# EAGLE design Adafruit Gemma rev B (EAGLE 6.4)
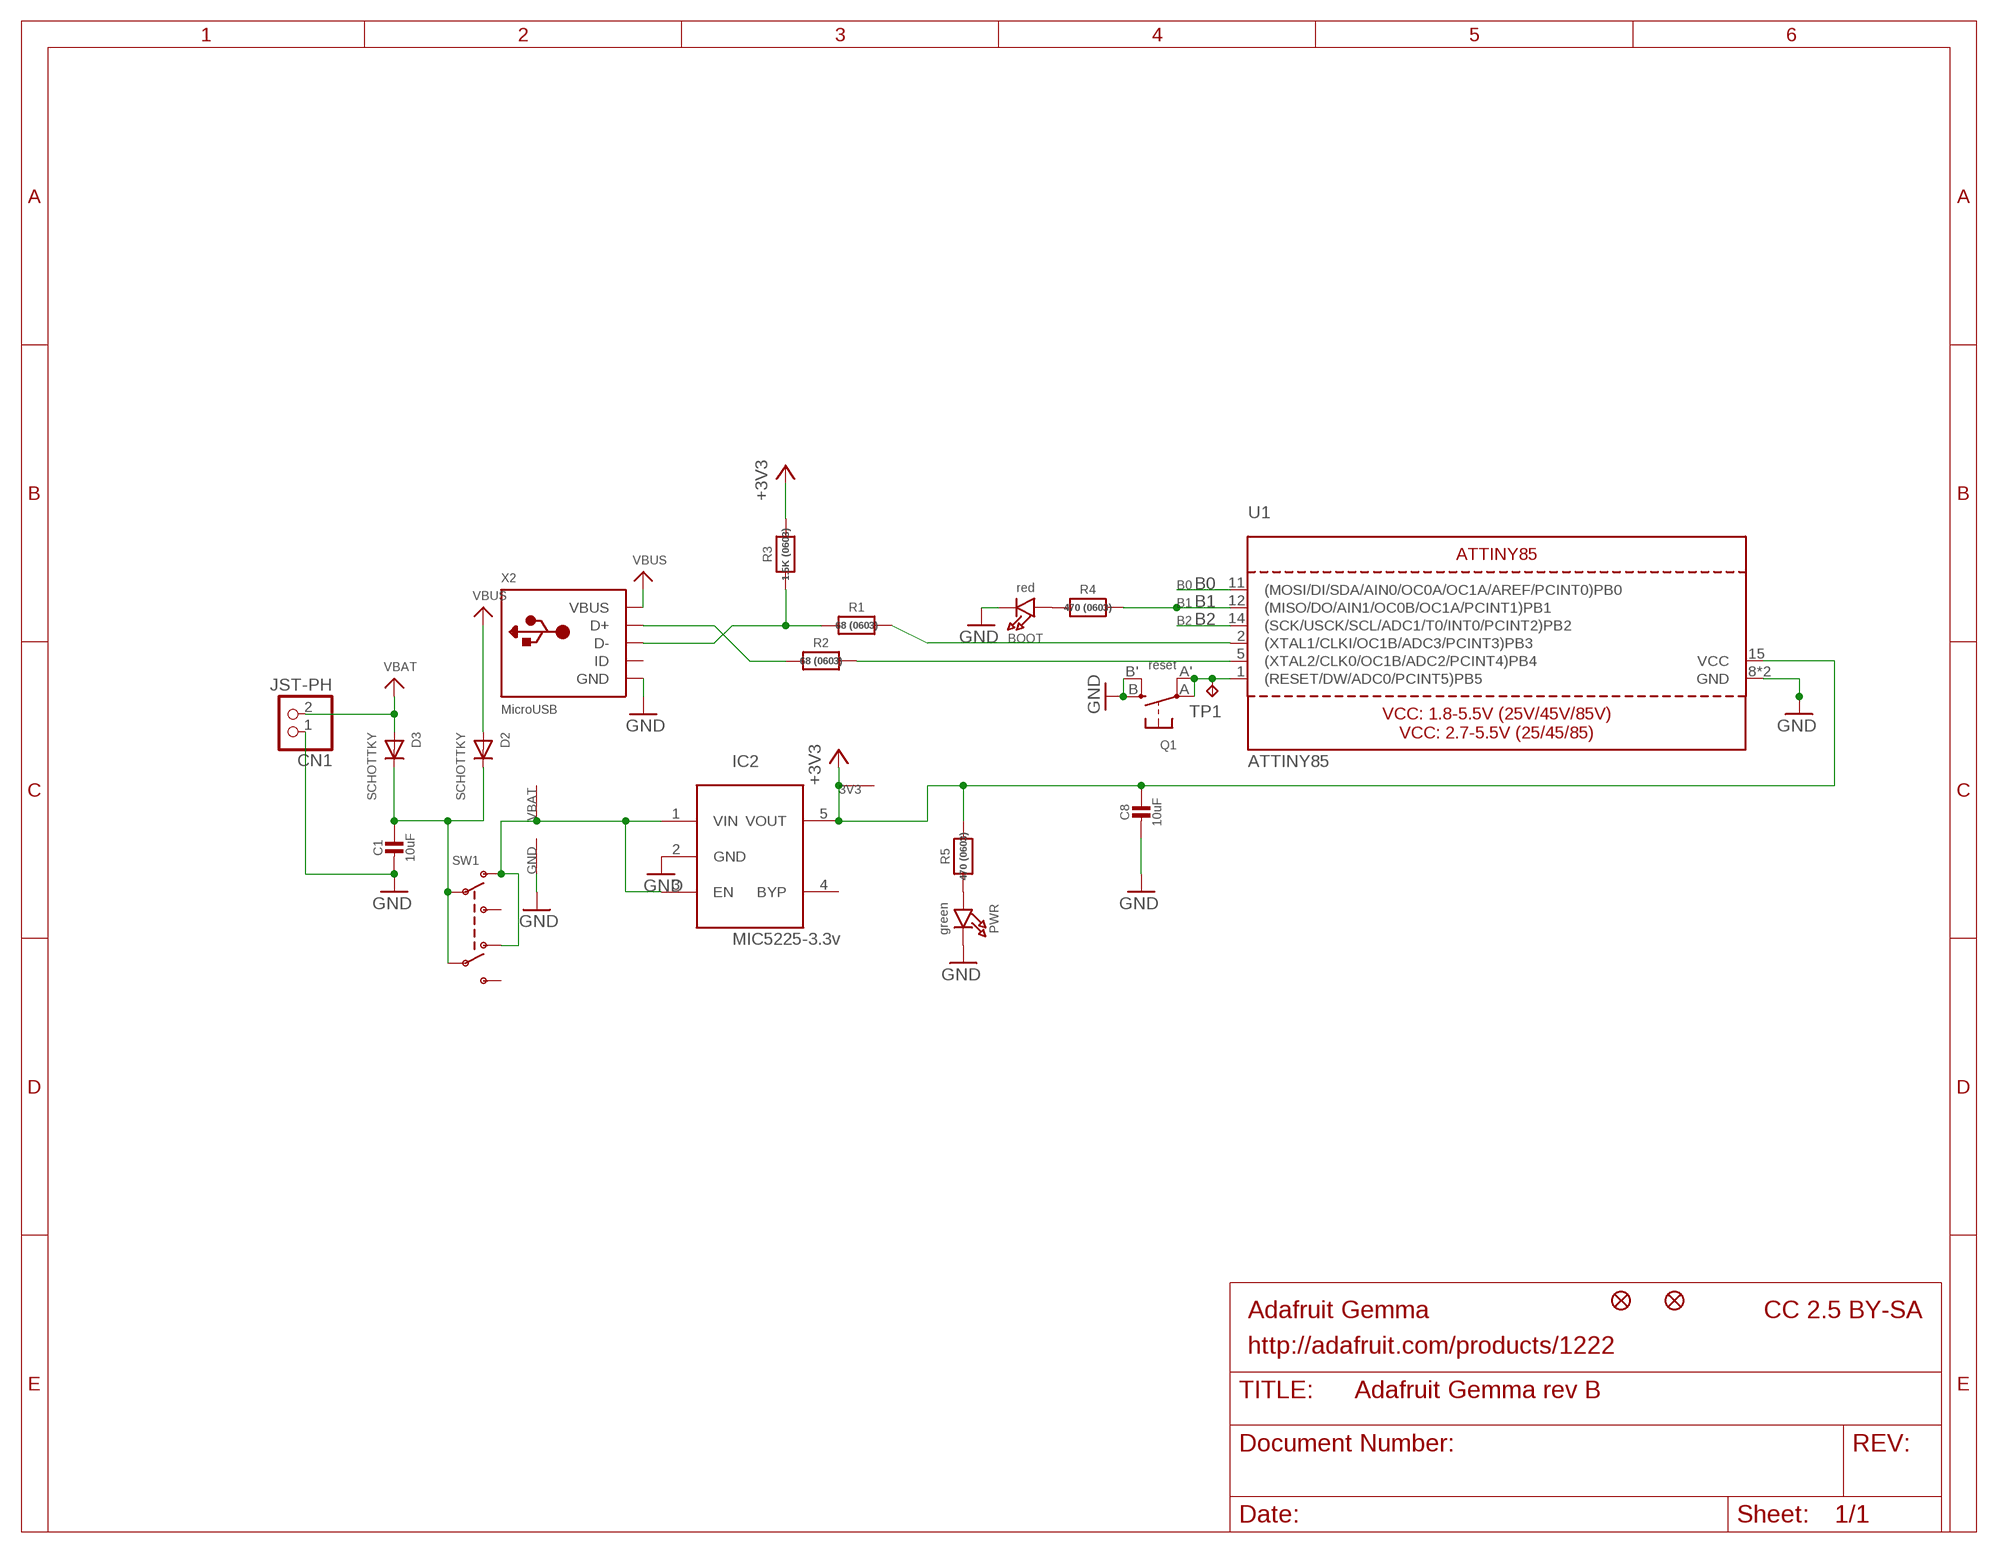
[diagram p0: schematic, sheet 1]

## Parts
3V3  SEWTAP-2.0IN  [SEWINGTAP_2.0]
B0  SEWTAP-2.0IN  [SEWINGTAP_2.0]
B1  SEWTAP-2.0IN  [SEWINGTAP_2.0]
B2  SEWTAP-2.0IN  [SEWINGTAP_2.0]
BOOT  red  LED0805_NOOUTLINE  [CHIPLED_0805_NOOUTLINE]
C1  10uF  CAP_CERAMIC0805-NOOUTLINE  [0805-NO]
C8  10uF  CAP_CERAMIC0805-NOOUTLINE  [0805-NO]
CN1  JST-PH  CON_JST_PH_2PIN  [JSTPH2]
D2  SCHOTTKY  DIODE_SOD-123FL  [SOD-123FL]
D3  SCHOTTKY  DIODE_SOD-123FL  [SOD-123FL]
GND  SEWTAP-2.0IN  [SEWINGTAP_2.0]
IC2  MIC5225-3.3v  LP298XS  [SOT23-5L]
PWR  green  LED0805_NOOUTLINE  [CHIPLED_0805_NOOUTLINE]
Q1  reset  SWITCH_TACT_SMT4.6X2.8  [BTN_KMR2_4.6X2.8]
R1  68 (0603)  RESISTOR_0603_NOOUT  [0603-NO]
R2  68 (0603)  RESISTOR_0603_NOOUT  [0603-NO]
R3  1.5K (0603)  RESISTOR_0603_NOOUT  [0603-NO]
R4  470 (0603)  RESISTOR_0603_NOOUT  [0603-NO]
R5  470 (0603)  RESISTOR_0603_NOOUT  [0603-NO]
SW1  SWITCH_DPDTEG1390  [EG1390]
TP1  TPB2,54  [B2,54]
U1  ATTINY85  [MLF20_4X4MM_0.5MM_ATMEL]
U$1  FIDUCIAL""  [FIDUCIAL_1MM]
U$6  FIDUCIAL""  [FIDUCIAL_1MM]
VBAT  SEWTAP-2.0IN  [SEWINGTAP_2.0]
X2  MicroUSB  USBMICRO_20329  [4UCONN_20329]

## Nets
+3V3: 3V3.P$1(SEW) C8.1 IC2.5(VOUT) R3.2 R5.2 U1.15(VCC)
B0: B0.P$1(SEW) U1.11((MOSI/DI/SDA/AIN0/OC0A/OC1A/AREF/PCINT0)PB0)
B1: B1.P$1(SEW) R4.2 U1.12((MISO/DO/AIN1/OC0B/OC1A/PCINT1)PB1)
B2: B2.P$1(SEW) U1.14((SCK/USCK/SCL/ADC1/T0/INT0/PCINT2)PB2)
GND: BOOT.C C1.2 C8.2 CN1.1 GND.P$1(SEW) IC2.2(GND) PWR.C Q1.B'(S1) Q1.B(S) U1.8(GND) U1.THERMAL(GND) X2.BASE@1(GND) X2.BASE@2(GND) X2.GND X2.SPRT@1(GND) X2.SPRT@2(GND) X2.SPRT@3(GND) X2.SPRT@4(GND)
N$1: Q1.A'(P1) Q1.A(P) TP1.TP U1.1((RESET/DW/ADC0/PCINT5)PB5)
N$2: R2.1 X2.D+
N$3: R1.2 U1.2((XTAL1/CLKI/OC1B/ADC3/PCINT3)PB3)
N$4: R2.2 U1.5((XTAL2/CLK0/OC1B/ADC2/PCINT4)PB4)
N$5: R1.1 R3.1 X2.D-
N$6: BOOT.A R4.1
N$7: IC2.1(VIN) IC2.3(EN) SW1.O1 SW1.O2 VBAT.P$1(SEW)
N$8: PWR.A R5.1
N$9: C1.1 D2.C D3.C SW1.P1 SW1.P2
VBAT: CN1.2 D3.A
VBUS: D2.A X2.VBUS
Unconnected: IC2.4(BYP) SW1.S1 SW1.S2 X2.ID

## Notes on the sheet
- Adafruit Gemma | CC 2.5 BY-SA
- http://adafruit.com/products/1222

## Library data of the parts
3V3 B0 B1 B2 GND VBAT = adafruit:SEWTAP
BOOT PWR = microbuilder:LED: LED 0603 - 0603 Surface Mount Package 2mA: Green LED - Low Power (3.9mcd, 2ma, 1.7Vf) - Digikey: 475-2709-2-ND Orange LED - Low Power (9.8mcd, 2ma, 1.8Vf) - Digikey: 475-1194-2-ND Red LED - Low Power (5mcd, 2ma, 1.8Vf) - Digikey: 475-1195-2-ND Yellow LED - Low Power (7mcd, 2ma, 1.8Vf) - Digikey: 475-1196-2-ND 5mA: Blue LED - Low Power (17mcd, 5ma, 2.9Vf) - Digikey: LNJ937W8CRACT-ND 0805 - 0805 Surface Mount Package 2mA: Red LED (8.8mcd, 2mA, 1.8Vf, Clear) - Low Power [Digikey: 475-2510-1-ND] Green LED (5mcd, 2mA, 1.8Vf, Clear) - Low Power [Digikey: 475-2730-1-ND] Yellow LED (11.3mcd, 2mA, 1.8Vf, Clear) - Low Power [Digikey: 475-2555-1-ND] 20mA: Red LED (104mcd, 20mA, Diffused) - LS R976 [Digikey: 475-1278-6-ND] Red LED (12mcd, 20mA, 2.0Vf, Clear) - APT2012EC [Digikey: 754-1128-1-ND] Green LED (15mcd, 20mA, 2.2Vf, Clear) - APT2012GC [Digikey: 754-1131-1-ND] Orange LED (160mcd, 20mA, 2.1Vf, Clear) - APT2012SECK [Digikey: 754-1130-1-ND] 1206 - 1206 Surface Mount Package Green LED (26mcd, 20mA, Diffused) - LG N971 [Digikey: 475-1407-6-ND] Red LED (15mcd, 20mA, Diffused) - LH N974 [Digikey: 475-1416-6-ND] Cree - Cree High-Power Surface Mount LEDs XPEBWT-L1-0000-00D50 - White 111lm 350mA 2.9Vf 6200K 110° XTEAWT-00-0000-00000LEE3 - White 114lm 350mA 2.85Vf 5000K 115° Everlight - Everlight 45-21 Series Surface Mount LEDs 45-21/QK2C-B2832AC2CB2/2T - Warm White 2000mcd 20mA 3.25Vf 3050K 120° 45-21/LK2C-B38452C4CB2/2T - Nuetral White 2000mcd 20mA 3.25Vf 4150K 120° 45-21/LK2C-B50634C6CB2/2T - Cold White 2200mcd 20mA 3.25Vf 5650K 120° PLCC2 Reverse Mount LS T77K-J1L2-1-0-2-R18-Z - Red 11.25mcd 2mA 1.8Vf 630nm 120° LO T77K-L1M2-24-Z - Orange 19.6mcd 2mA 1.8Vf 606nm 120° LY T77K-K2M1-26-Z - Yellow 15.7mcd 2mA 1.8Vf 587nm 120°
C1 C8 = microbuilder:CAP_CERAMIC: Ceramic Capacitors For new designs, use the packages preceded by an '_' character since they are more reliable: The following footprints should be used on most boards: _0402 - Standard footprint for regular board layouts _0603 - Standard footprint for regular board layouts _0805 - Standard footprint for regular board layouts _1206 - Standard footprint for regular board layouts For extremely tight-pitch boards where space is at a premium, the following 'micro-pitch' footprints can be used (smaller pads, no silkscreen outline, etc.): _0402MP - Micro-pitch footprint for very dense/compact boards _0603MP - Micro-pitch footprint for very dense/compact boards _0805MP - Micro-pitch footprint for very dense/compact boards _1206MP - Micro-pitch footprint for very dense/compact boards
CN1 = microbuilder:CON_JST_PH_2PIN: JST 2-Pin Right-Angle Connector PH-Series - 4UConnector: 17311 SH-Series - 4UConnector: 07278
D2 D3 = adafruit:DIODE: Diode SMADIODE - SMA Surface Mount Package 20V 1A Schottky Diode Digikey: 641-1014-6-ND DO-1N4148 - Through Hole Small Current Diode SOD-123 20V 1 A (.5mV Vf) Schottky Diode - Digikey: MBRX120TPMSCT-ND SOD-323 10V 570mA (.38mV Vf, 3ns) Schottky Diode - Digikey: ZLLS410CT-ND SOD-523 30V 30mA Schottky Diode (RB751S-40TE61) - Digikey: RB751S-40TE61CT-ND SOT23-R/W - SOT23 Package (R = Solder Paste/Reflow Ovens, W = Hand-Soldering) BAT54Film 40V 300mA - Digikey: 497-7162-1-ND
IC2 = adafruit:LP298X
Q1 = microbuilder:SWITCH_TACT_SMT: SMT Tact Switches 6x6mm - Digikey: P12940SCT-ND KMR2 (4.6x2.8mm) - Digikey: 401-1426-1-ND EVQ-PQHB55 - Light Touch, 160GF (4.5x4.5mm) - Digikey: P8090SCT-ND KMT0 - KMT021 NGJ LHS (etc.) IP68/Waterproof - Digikey: CKN10289CT-ND
R1-R5 = microbuilder:RESISTOR: Resistors For new designs, use the packages preceded by an '_' character since they are more reliable: The following footprints should be used on most boards: _0402 - Standard footprint for regular board layouts _0603 - Standard footprint for regular board layouts _0805 - Standard footprint for regular board layouts _1206 - Standard footprint for regular board layouts For extremely tight-pitch boards where space is at a premium, the following 'micro-pitch' footprints can be used (smaller pads, no silkscreen outline, etc.): _0402MP - Micro-pitch footprint for very dense/compact boards _0603MP - Micro-pitch footprint for very dense/compact boards _0805MP - Micro-pitch footprint for very dense/compact boards _1206MP - Micro-pitch footprint for very dense/compact boards
SW1 = microbuilder:SWITCH_DPDT: Switch - DPDT A DPDT Switch acts like an SPDT switch, but has a pair of switches instead of just one. Vertical - 0.3A @ 6V SMT - Digikey: JS202011SCQN
TP1 = testpad:TP: Test pad
U1 = microbuilder:ATTINY85: ATTINT85
U$1 U$6 = microbuilder:FIDUCIAL: Fiducial Alignment Points Various fiducial points for machine vision alignment.; BOM: EXCLUDE
X2 = microbuilder:USB: USB Connectors USBMINIB - Surface Mount Female Mini-B USB Connector 4UConnector: 06564

## Board
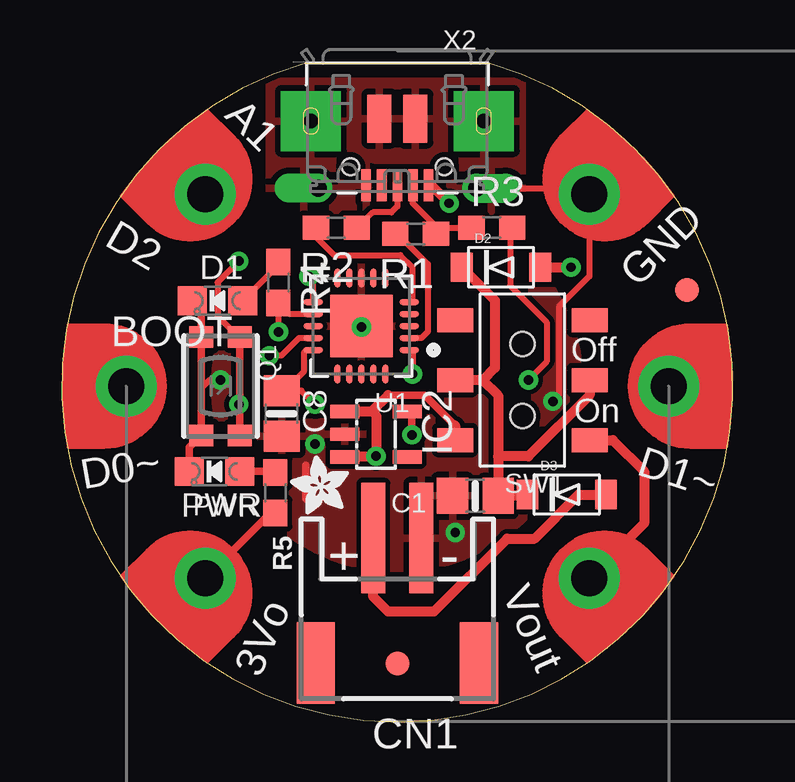
[diagram p1: board, top side]
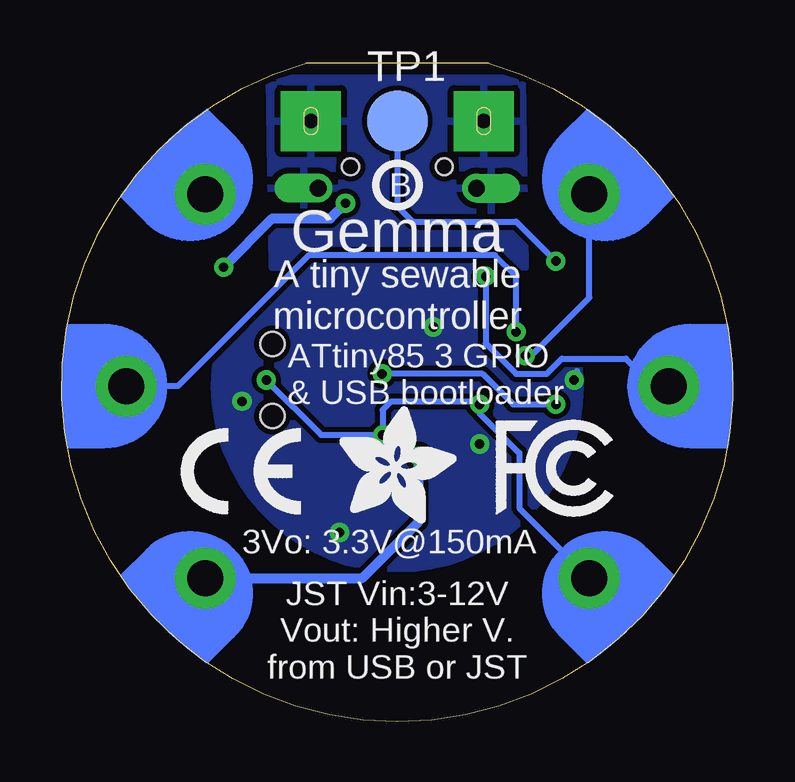
[diagram p2: board, bottom side, seen from below]

Size 27.97 x 27.46 mm. Coordinates in mm from the lower left corner, seen from the top.
Outline: 10.17,27.46 17.79,27.46 arc-328 10.17,27.46
Copper layers (1*16): Top 0.035mm / dielectric 1.5mm / Bottom 0.035mm
Design rules "adafruit *": minimum track width 8mil, minimum drill 15.5mil, track to track 8mil, track to pad 8mil, pad to pad 8mil, via to via 8mil, smd to smd 8mil, copper to edge 10mil, drill to drill 8mil, minimum pad ring 10mil, minimum via ring 8mil, stop-mask expansion 2mil, vias tented up to drill 20mil, thermal gap 10mil

### Footprints (pad centres in the part's own frame; a part is rotated, then mirrored left to right if it is on the bottom)
SEWINGTAP_2.0 = drill 1.5 pad 2.54: P$1 0,0
CHIPLED_0805_NOOUTLINE = smd 1.2 x 1.2: A 0,-1.05; C 0,1.05
0805-NO = smd 1.3 x 1.5: 1 -0.95,0; 2 0.95,0
JSTPH2 = smd 1 x 4.6: 1 -1,-3.7; 2 1,-3.7 | smd 1.6 x 3.4: NC1 -3.4,1.5; NC2 3.4,1.5
SOD-123FL = smd 0.91 x 1.22: A 1.637,0; C -1.637,0
SOT23-5L = smd 0.55 x 1.2: 1 -0.95,-1.3; 2 0,-1.3; 3 0.95,-1.3; 4 0.95,1.3; 5 -0.95,1.3
BTN_KMR2_4.6X2.8 = smd 0.9 x 1: A 2.05,0.8; A' -2.05,0.8; B 2.05,-0.8; B' -2.05,-0.8
0603-NO = smd 1.1 x 1: 1 -0.85,0; 2 0.85,0
EG1390 = smd 1 x 1.5: O1 -2.5,2.8; O2 -2.5,-2.8; P1 0,2.8; P2 0,-2.8; S1 2.5,2.8; S2 2.5,-2.8 | hole 1: 1.5,0; -1.5,0
B2,54 = smd 2.54 x 2.54: TP 0,0
MLF20_4X4MM_0.5MM_ATMEL = smd 0.8 x 0.25: 1 -2,1; 2 -2,0.5; 3 -2,0; 4 -2,-0.5; 5 -2,-1; 11 2,-1; 12 2,-0.5; 13 2,0; 14 2,0.5; 15 2,1 | smd 0.25 x 0.8: 6 -1,-2; 7 -0.5,-2; 8 0,-2; 9 0.5,-2; 10 1,-2; 16 1,2; 17 0.5,2; 18 0,2; 19 -0.5,2; 20 -1,2 | smd 2.6 x 2.6: THERMAL 0,0
FIDUCIAL_1MM = smd 1 x 1: 1 0,0
4UCONN_20329 = smd 1 x 2: BASE@1 -0.75,-2; BASE@2 0.75,-2 | smd 0.4 x 1.35: D+ 0,0.775; D- -0.65,0.775; GND 1.3,0.775; ID 0.65,0.775; VBUS -1.3,0.775 | drill 0.7 offset: SPRT@1 -3.3,0.9; SPRT@2 3.3,0.9 | drill 0.6 pad 2.5 square: SPRT@3 -3.6,-1.9; SPRT@4 3.6,-1.9 | hole 0.7: -1.95,0; 1.95,0

### Placement (x,y rotation side)
3V3  5.98,5.99 135 top
B0  2.68,14 90 top
B1  25.29,14 270 top
B2  5.98,22 45 top
BOOT  6.49,17.55 90 top
C1  17.23,9.42 180 top
C8  9.16,12.85 270 top
CN1  13.98,3.96 180 top
D2  18.3,18.95 0 top
D3  21.04,9.48 0 top
GND  21.99,22 315 top
IC2  13.1,11.99 270 top
PWR  6.36,10.44 90 top
Q1  6.62,14 270 top
R1  14.75,20.35 180 top
R2  11.44,20.6 180 top
R3  17.92,20.6 0 top
R4  9.03,18.31 270 top
R5  8.9,9.55 270 top
SW1  19.19,14.25 90 top
TP1  13.98,25.04 0 bottom
U1  12.48,16.5 180 top
U$1  26.06,17.99 90 top
U$2  [ADAFRUIT_2.5MM]  11.95,8.66 90 top
U$6  13.98,2.44 0 top
U$7  [ADAFRUIT_5MM]  16.4,8.28 0 bottom
U$8  [SYMBOL_FCC_5MM]  9.92,8.53 0 bottom
U$9  [SYMBOL_CE_5MM]  23,8.66 0 bottom
U$10  [PCBFEAT-REV-040]  13.98,22.38 0 bottom
VBAT  21.99,5.99 225 top
X2  13.98,23.14 180 top

### Tracks (layer width: path | path; a pad name or v marks a point on that pad's centre or on a via)
+3V3  (via drill 0.39)
  Top 0.254: R3.2 18.68,20.51 18.68,18.19 20.21,16.66 20.21,15.01 v19.45,14.25 | U1.15 10.18,15.5 10.08,15.4 10.08,14.6 9.29,13.8 C8.1 9.99,13.8 v10.56,13.23
  Top 0.305: R5.2 8.69,8.7 3V3.P$1 | IC2.5 14.59,12.74 v14.59,11.96
  Bottom 0.254: 3V3.P$1 8.9,8.92 8.9,11.2 10.56,12.85 v10.56,13.23 10.68,13.36 14.24,13.36 14.59,13 v14.59,11.96 17.16,11.96 v19.45,14.25
B0  (via drill 0.39)
  Top 0.254: U1.11 10.48,18.38 v10.3,18.57
  Bottom 0.254: v10.3,18.57 10.3,15.77 9.03,14.5 7.76,14.5 7.13,15.14 4.46,15.14 3.32,14 B0.P$1
B1  (via drill 0.39)
  Top 0.254: v9.03,16.25 R4.2 9.5,17 U1.12
  Bottom 0.254: v9.03,16.25 9.03,18.57 9.92,19.46 17.67,19.46 23.13,14 B1.P$1
B2  (via drill 0.39)
  Top 0.254: U1.14 9.88,16 9.15,15.27 v8.65,15.27
  Bottom 0.254: B2.P$1 5.98,17.68 8.4,15.27 v8.65,15.27 8.52,15.27
GND  (via drill 0.39)
  Top 0.254: 15.25,8.28 14.98,8.01 CN1.1 | 5.82,13.91 6.15,14.25 v6.62,14.25 | X2.SPRT@1 21.99,22.24 GND.P$1 21.99,18.57 20.72,17.3 20.72,13.61 v20.46,13.36
  Top 0.305: PWR.C 5.31,11.44 Q1.B 5.82,13.91 Q1.B' 5.82,17.17 BOOT.C | C8.2 9.35,11.9 | 10.17,10.69 10.17,9.3
  Bottom 0.254: v6.62,14.25 6.49,14.38 6.49,14.63
  other vias: 10.56,11.58 16.4,7.9 12.49,16.45
  pour Bottom: 6.36,14 arc90 13.98,6.38 arc90 21.6,14 arc90 13.98,21.62 arc90
  pour Bottom: 8.78,26.82 8.65,18.95 19.19,18.95 19.32,26.82
  pour Top: 6.36,14 arc90 13.98,6.38 arc90 21.6,14 arc90 13.98,21.62 arc90
  pour Top: 8.65,26.7 8.65,18.95 19.19,18.95 19.19,26.7
N$1  (via drill 0.39)
  Top 0.254: 7.51,13.36 v7.38,13.23 7.42,13.2 Q1.A | v7.38,19.2 6.49,18.31 6.49,16.92 7.36,16.05 Q1.A' | U1.1 14.6,15.5 14.62,15.47 v14.62,14.5
  Top 0.305: Q1.A Q1.A'
  Bottom 0.254: v7.38,13.23 9.16,13.23 10.43,14.5 v14.62,14.5 | TP1.TP 13.98,21.49 13.35,20.85 9.03,20.85 v7.38,19.2
N$2
  Top 0.254: X2.D+ 13.98,21.49 13.73,21.23 12.97,21.23 12.33,20.6 R2.1
N$3
  Top 0.254: U1.2 14.98,16 15.25,16.27 15.25,19.08 13.98,20.35 R1.2
N$4
  Top 0.254: U1.5 14.62,17.63 14.62,18.95 14.11,19.46 11.36,19.46 10.59,20.22 R2.2
N$5
  Top 0.254: 15.85,20.38 15.76,20.47 | 15.76,20.47 14.62,21.62 14.62,22.35 X2.D- | R1.1 15.76,20.51 | R3.1 15.85,20.6 15.76,20.51 | 15.76,20.51 15.76,20.47
N$6
  Top 0.254: R4.1 8.99,19.16 8.99,19 BOOT.A
N$7  (via drill 0.39)
  Top 0.305: 13.6,13.61 15.13,13.61 16.39,12.35
  Top 0.406: SW1.O2 22.96,11.75 24.27,10.44 24.27,8.28 VBAT.P$1 | IC2.1 12.93,12.94 | 12.93,12.94 13.6,13.61 | 16.39,12.35 SW1.O1 | IC2.3 11.83,11.07 v13.1,11.07 13.1,12.77 12.93,12.94
  Bottom 0.406: VBAT.P$1 15.45,5.99 13.1,8.35 v13.1,11.07
N$8
  Top 0.305: PWR.A 8.87,10.44 R5.1
N$9
  Top 0.254: D3.C 19.35,9.42
  Top 0.406: D2.C 18.05,17.57 18.05,14.76 17.54,14.25 | 17.54,14.25 18.18,13.61 18.18,11.07 | 17.54,14.25 SW1.P1 | SW1.P2 21.99,13.62 19.44,11.07 18.18,11.07 | 18.18,11.07 C1.1 19.35,9.42
VBAT
  Top 0.406: CN1.2 12.98,5.22 13.6,4.6 15.51,4.6 18.56,7.65 19.7,7.65 21.53,9.48 D3.A
VBUS  (via drill 0.39)
  Top 0.406: X2.VBUS 15.39,22.36 v16.14,21.62 | D2.A v21.22,18.95
  Bottom 0.406: v16.14,21.62 16.78,20.98 19.19,20.98 v21.22,18.95

### Text on the board
tPlace: A1 | D2 | D1 | GND | Off | On | D0~ | D1~ | PWR | + | - | Vout | 3Vo
bPlace: Gemma | A tiny sewable / microcontroller | ATtiny85 3 GPIO | & USB bootloader | 3Vo: 3.3V@150mA | JST Vin:3-12V / Vout: Higher V. / from USB or JST
tDocu: SCL/SCK | GND | SDA/MOSI | MISO | 3-16VDC